# Altium schematic sheet Sheet1.SchDoc
size A4; SheetNumber: 1; SheetTotal: 2
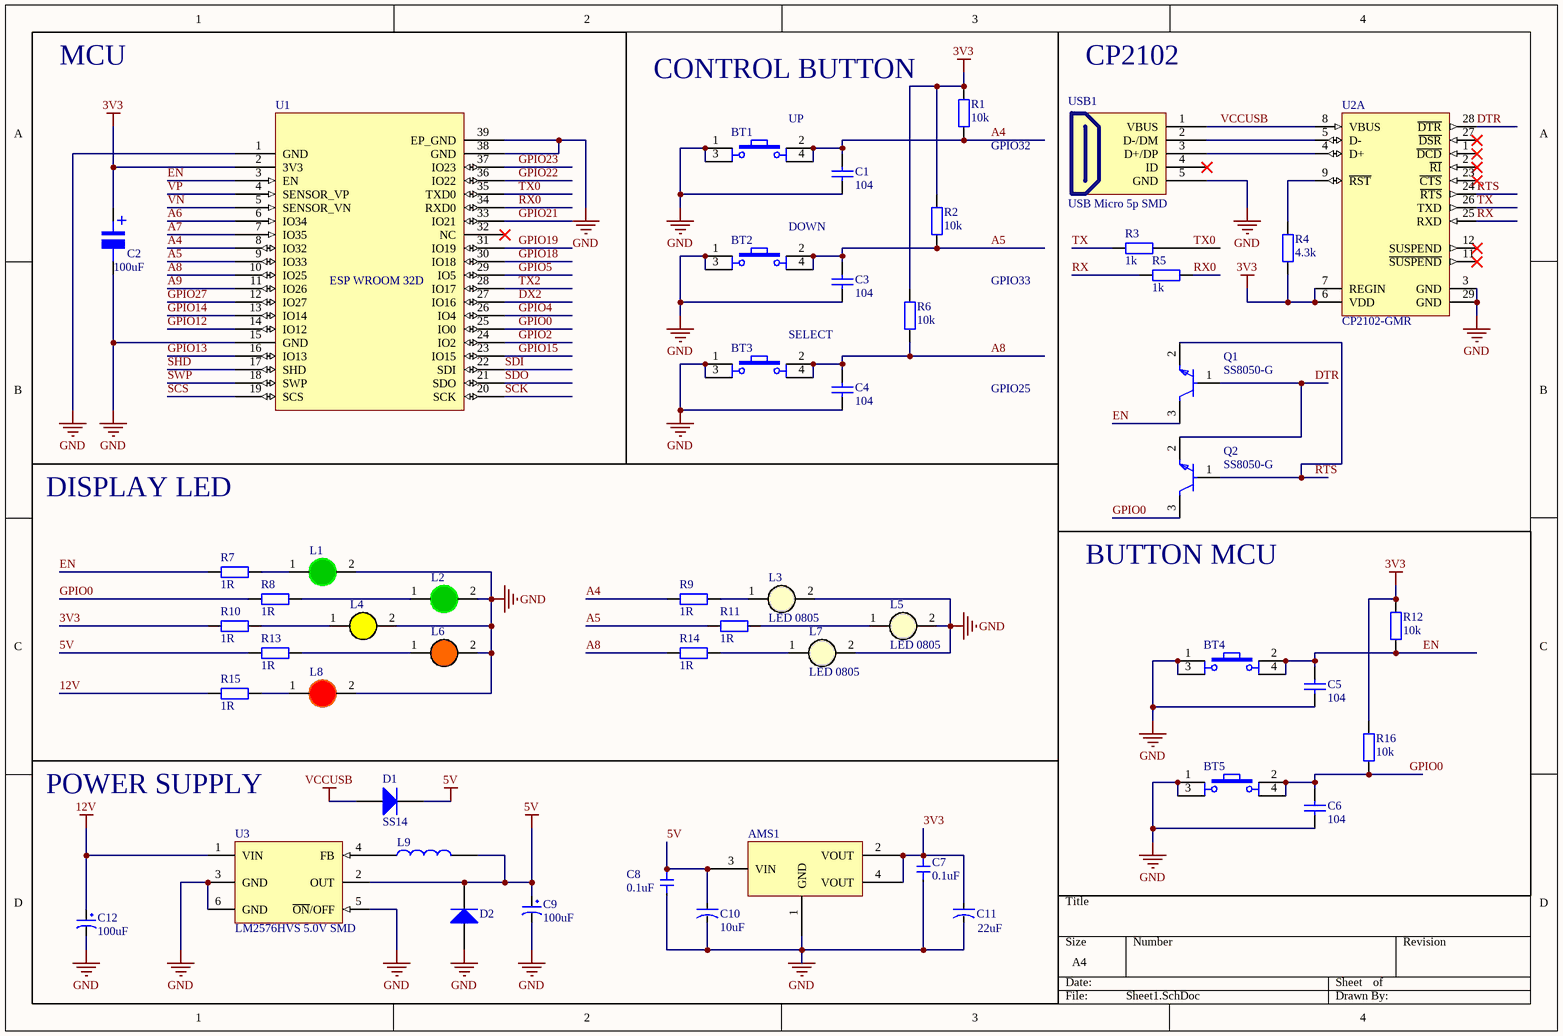
[diagram p0: Sheet1.SchDoc]

## Parts
AMS1  AMS1117-3.3V  [SOT223]  (value not drawn)
BT1  Nut Nhan 4 Chan SMD 6x6  [Nut Nhan 4 Chan SMD 6x6]  (value not drawn)
BT2  Nut Nhan 4 Chan SMD 6x6  [Nut Nhan 4 Chan SMD 6x6]  (value not drawn)
BT3  Nut Nhan 4 Chan SMD 6x6  [Nut Nhan 4 Chan SMD 6x6]  (value not drawn)
BT4  Nut Nhan 4 Chan SMD 6x6  [Nut Nhan 4 Chan SMD 6x6]  (value not drawn)
BT5  Nut Nhan 4 Chan SMD 6x6  [Nut Nhan 4 Chan SMD 6x6]  (value not drawn)
C1  104  [tu 0603]
C2  100uF  [tu nhom 6.3 (d)]
C3  104  [tu 0603]
C4  104  [tu 0603]
C5  104  [tu 0603]
C6  104  [tu 0603]
C7  0.1uF  [Cap 0805]
C8  0.1uF  [Cap 0805]
C9  100uF  [tu hoa 8mm]
C10  10uF  [CAP-ALU-SMD-6.3x7.7x2.2]
C11  22uF  [CAP-ALU-SMD-6.3x7.7x2.2]
C12  100uF  [tu hoa 8mm]
D1  SS14  [DIODE SMA]
D2  SS34  [DIODE SMA]  (value not drawn)
L1  LED 0805  [LED-0805-Green]  (value not drawn)
L2  LED 0805  [LED-0805-Green]  (value not drawn)
L3  LED 0805  [LED-0805-Yellow]
L4  LED 0805  [LED-0805-Yellow]  (value not drawn)
L5  LED 0805  [LED-0805-Yellow]
L6  LED 0805  [LED-0805-Orange]  (value not drawn)
L7  LED 0805  [LED-0805-Yellow]
L8  LED 0805  [LED-0805-Red]  (value not drawn)
L9  100uH - 3A SMD  [Cuon Cam 12x12x10]  (value not drawn)
Q1  SS8050-G  [FP-SS8050-G-IPC_B]
Q2  SS8050-G  [FP-SS8050-G-IPC_B]
R1  10k  [tro smd 0603]
R2  10k  [tro smd 0603]
R3  1k  [tro smd 0603]
R4  4.3k  [tro smd 0603]
R5  1k  [tro smd 0603]
R6  10k  [tro smd 0603]
R7  1R  [tro vach 1/4w]
R8  1R  [tro vach 1/4w]
R9  1R  [tro vach 1/4w]
R10  1R  [tro vach 1/4w]
R11  1R  [tro vach 1/4w]
R12  10k  [tro smd 0603]
R13  1R  [tro vach 1/4w]
R14  1R  [tro vach 1/4w]
R15  1R  [tro vach 1/4w]
R16  10k  [tro smd 0603]
U1  Component_1  [ESP32-WROOM-32D]  (value not drawn)
U2  CP2102-GMR  [SLAB-QFN-28-3125x3125TP_M]  (part A of 2)
U3  LM2576HVS 5.0V SMD  [TO263-5]
USB1  USB Micro 5p SMD  [USB Micro 5p SMD]

## Blocks framed on the sheet
DISPLAY LED: L1-L8 R7-R11 R13-R15
BUTTON MCU: BT4 BT5 C5 C6 R12 R16
POWER SUPPLY: AMS1 C7-C12 D1 D2 L9 U3

## Nets
3V3: AMS1.2(VOUT) AMS1.4(VOUT) C2.1 C7.1 C11.1 R1.2 R2.2 R4.1 R6.2 R10.1 R12.2 R16.2 U1.2(3V3) U2.6(VDD) U2.7(REGIN)
5V: AMS1.3(VIN) C8.1 C9.1 C10.1 D1.2(K) D2.2(K) L9.2 R13.1 U3.2(OUT)
12V: C12.1 R15.1 U3.1(VIN)
GND: AMS1.1(GND) BT1.1 BT1.3 BT2.1 BT2.3 BT3.1 BT3.3 BT4.1 BT4.3 BT5.1 BT5.3 C1.2 C2.2 C3.2 C4.2 C5.2 C6.2 C7.2 C8.2 C9.2 C10.2 C11.2 C12.2 D2.1(A) L1.2(K) L2.2(K) L3.2(K) L4.2(K) L5.2(K) L6.2(K) L7.2(K) L8.2(K) U1.1(GND) U1.15(GND) U1.38(GND) U1.39(EP_GND) U2.3(GND) U2.29(GND) U3.3(GND) U3.5(~{ON}/OFF) U3.6(GND) USB1.5(GND)
VCCUSB: D1.1(A) U2.8(VBUS) USB1.1(VBUS)
A4: BT1.2 BT1.4 C1.1 R1.1 R9.1 U1.8(IO32)
A5: BT2.2 BT2.4 C3.1 R2.1 R11.1 U1.9(IO33)
A6: U1.6(IO34)
A7: U1.7(IO35)
A8: BT3.2 BT3.4 C4.1 R6.1 R14.1 U1.10(IO25)
A9: U1.11(IO26)
DTR: Q1.1(B) Q2.2(E) U2.28(~{DTR})
DX2: U1.27(IO16)
EN: BT4.2 BT4.4 C5.1 Q1.3(C) R7.1 R12.1 U1.3(EN)
GPIO0: BT5.2 BT5.4 C6.1 Q2.3(C) R8.1 R16.1 U1.25(IO0)
GPIO2: U1.24(IO2)
GPIO4: U1.26(IO4)
GPIO5: U1.29(IO5)
GPIO12: U1.14(IO12)
GPIO13: U1.16(IO13)
GPIO14: U1.13(IO14)
GPIO15: U1.23(IO15)
GPIO18: U1.30(IO18)
GPIO19: U1.31(IO19)
GPIO21: U1.33(IO21)
GPIO22: U1.36(IO22)
GPIO23: U1.37(IO23)
GPIO27: U1.12(IO27)
RTS: Q1.2(E) Q2.1(B) U2.24(~{RTS})
RX: R5.1 U2.25(RXD)
RX0: R5.2 U1.34(RXD0)
SCK: U1.20(SCK)
SCS: U1.19(SCS)
SDI: U1.22(SDI)
SDO: U1.21(SDO)
SHD: U1.17(SHD)
SWP: U1.18(SWP)
TX: R3.1 U2.26(TXD)
TX0: U1.35(TXD0)
TX2: U1.28(IO17)
VN: U1.5(SENSOR_VN)
VP: U1.4(SENSOR_VP)
NetL1_1: L1.1(A) R7.2
NetL2_1: L2.1(A) R8.2
NetL3_1: L3.1(A) R9.2
NetL4_1: L4.1(A) R10.2
NetL5_1: L5.1(A) R11.2
NetL6_1: L6.1(A) R13.2
NetL7_1: L7.1(A) R14.2
NetL8_1: L8.1(A) R15.2
NetL9_1: L9.1 U3.4(FB)
NetR4_2: R4.2 U2.9(~{RST})
NetU2_4: U2.4(D+) USB1.3(D+/DP)
NetU2_5: U2.5(D-) USB1.2(D-/DM)

Not connected (* = marked no-connect by the designer): R3 2; U1 32(NC)*; U2 1(~{DCD})* 2(~{RI})* 11(~{SUSPEND})* 12(SUSPEND)* 23(~{CTS})* 27(~{DSR})*; USB1 4(ID)*

## Notes on the sheet
- MCU
- CONTROL BUTTON
- CP2102
- (near BT1) UP
- (near R1) GPIO32
- (near BT2) DOWN
- GPIO33
- (near BT3) SELECT
- GPIO25
- Labels drawn without touching a wire or pin: TX0
- (in symbol Component_1) ESP WROOM 32D
- (in symbol Tu Nhom 100uF 16V) +

## Library data of the parts
AMS1 = AMS1117 SMD: Dán; Value: AMS1117-3.3V SOT223; Don_Vi: Con; Ma_Hang: MH000596; Ghi_Chu: *; Kieu_Chan: *; Chung_Loai: Dán
BT1-BT5 = Nut Nhan 4 Chan SMD 6x6: Nut Nhan 4 Chan 6.2x6.2x3.5; Ten: Nút Nhấn 4 Chân 6.2x6.2x3.1MM SMD; Ma_Hang: MH002424
C1 C3-C6 = Tu 0603 104 50V 10%: Dán; Don_Vi: Con; So_Chan: 2; Ten_Linh_Kien: Tụ 0603 104-100nF 10% 50V; Ma_Hang: MH004568; Chung_Loai: Dán; Kieu_Chan: *
C2 = Tu Nhom 100uF 16V: Dán; Don_Vi: Con; So_Chan: 2; Ten_Linh_Kien: Tụ Nhôm 100uF 16V 6.3x5.4MM; Ma_Hang: MH002219; Chung_Loai: Dán; Kieu_Chan: *
C7 C8 = Cap 0805: Capacitor SMD 0805
C9 C12 = Tu Hoa 100uF 50V 8x11: Cắm; Don_Vi: Con; So_Chan: 2; Ten_Linh_Kien: Tụ Hóa 100uF 50V 8x11MM; Ma_Hang: MH006872; Chung_Loai: Cắm; Kieu_Chan: *
C10 C11 = CN-ALU-SMD: Polarized Capacitor (Axial); Published: 8-Jun-2000; LatestRevisionDate: 17-Jul-2002; LatestRevisionNote: Re-released for DXP Platform.; PackageReference: POLAR0.8; Publisher: Altium Limited
D1 = Diode SS14 ( 1N5819): Dán; Ma_Hang: MH002211; Don_Vi: Con; Ten_Linh_Kien: Diode SS14 DO214 Schottky 1A 40V ( 1N5819 DO214); Chung_Loai: Dán; Ghi_Chu: *; Kieu_Chan: *
D2 = Diode SS34 ( 1N5822 ): Dán; Don_Vi: Con; Ma_Hang: MH002104; Ten_Linh_Kien: Diode SS34 3A 40V SMA ( 1N5822 SS34A); Kieu_Chan: *; Chung_Loai: Dán
L1 L2 = LED 0805 Xanh La: Dán; Don_Vi: Con; Ma_Hang: MH002326; Ten_Linh_Kien: LED 0805 Màu Xanh Lá (Green); Ghi_Chu: *; Kieu_Chan: *; Chung_Loai: Dán
L3 L5 L7 = LED 0805 Trang: Dán; Don_Vi: Con; Ma_Hang: MH002946; Ten_Linh_Kien: LED 0805 Màu Trắng ( White); Ghi_Chu: *; Kieu_Chan: *; Chung_Loai: Dán
L4 = LED 0805 Vang: Dán; Don_Vi: Con; Ma_Hang: MH002329; Ten_Linh_Kien: LED 0805 Màu Vàng ( Yellow); Ghi_Chu: *; Kieu_Chan: *; Chung_Loai: Dán
L6 = LED 0805 Cam: Dán; Don_Vi: Con; Ma_Hang: MH002328; Ten_Linh_Kien: LED 0805 Màu Cam ( Orange); Ghi_Chu: *; Kieu_Chan: *; Chung_Loai: Dán
L8 = LED 0805 Do: Dán; Don_Vi: Con; Ma_Hang: MH000897; Ten_Linh_Kien: LED 0805 Màu Đỏ (Red); Ghi_Chu: *; Kieu_Chan: *; Chung_Loai: Dán
L9 = CUON CAM 100uH SMD: Dán; Don_Vi: Con; Ma_Hang: MH003999; Ten_Linh_Kien: Cuộn Cảm 100uH 7x7x4MM CD74; Ma_Hang: *; Kieu_Chan: *; Chung_Loai: Dán
Q1 Q2 = CMP-20235-000001-1: NPN TRANSISTOR 1.5A 40V SOT-23 R; Transition Frequency: 100MHz; Max Breakdown Voltage: 25V; Collector Emitter Voltage (VCEO): 400mV; Max Power Dissipation: 300mW; Max Collector Current: 1.5A; Case/Package: TO-236-3; Packaging: Tape and Reel; RoHS Compliant: Yes; Mount: Surface Mount; Collector Emitter Breakdown Voltage: 25V
R1 R2 R6 R12 R16 = Tro 0603 1% 10k: Dán; Don_Vi: Con; So_Chan: 2; Ten_Linh_Kien: Trở 0603 1% 10k; Ma_Hang: MH006333; Chung_Loai: Dán; Kieu_Chan: *
R3 R5 = Tro 0603 1% 1k: Dán; So_Chan: 2; Don_Vi: Con; Ten_Linh_Kien: Trở 0603 1% 1k; Ma_Hang: MH006334; Chung_Loai: Dán; Kieu_Chan: *
R4 = Tro 0603 1% 4.3 k: Dán; Don_Vi: Con; So_Chan: 2; Ten_Linh_Kien: Trở 0603 1% 4.3k; Ma_Hang: MH008715; Chung_Loai: Dán; Kieu_Chan: *
R7-R11 R13-R15 = Tro Vach 1/4W 5% 1R: Cắm; Don_Vi: Con; So_Chan: 2; Ten_Linh_Kien: Trở Vạch 1/4w 5% 1R; Ma_Hang: MH007394; Chung_Loai: Cắm; Kieu_Chan: *
U2 = CMP-2000-04924-1: Single-Chip USB to URAT Bridge, 3.3 V, -40 to 85 degC, 28-Pin QFN, RoHS, Tape and Reel; Manufacturer: Silicon Labs; Interface Circuit Standard 1: RS-232; Transmitter and Receiver FIFO Counter: No; Supply Current: 26mA; Operating Supply Voltage (Min): 3V; Operating Supply Voltage (Typ): 3.3V; Data Rate: 1000kbps; Operating Supply Voltage (Max): 3.6V; Number of Channels: 1; Package URL: http://www.silabs.com/Support%20Documents/TechnicalDocs/C8051T61x.pdf; Operating Temperature (Max): 85C; Datasheet URL: http://www.mouser.com/ds/2/368/CP2102-9-247052.pdf; Operating Temperature Classification: Industrial; Operating Temperature (Min): -40C; Package Description: 28-Pin Quad-Flat No-Leads Package, Body 5 x 5 mm, Pitch 0.5 mm; Manufacturer URL: http://www.silabs.com/; Rad Hardened: No; Package Reference: QFN-28; Pin Count: 28; Packaging: TapeandReel; Mounting: SurfaceMount; Package Type: QFNEP; Datasheet Version: Rev. 1.6, 12/2013
U3 = LM2576HVS 5.0V SMD: Dán; Ten_Linh_Kien: LM2576HVS-5.0V BUCK 5V 3A TO263-5; Don_Vi: Con; Ma_Hang: MH002362; Ghi_Chu: *; Kieu_Chan: *; Chung_Loai: Dán
USB1 = USB Micro 5p SMD: USB Type B; Ten: MicroUSB MK5P SMD; Ma_Hang: MH001020